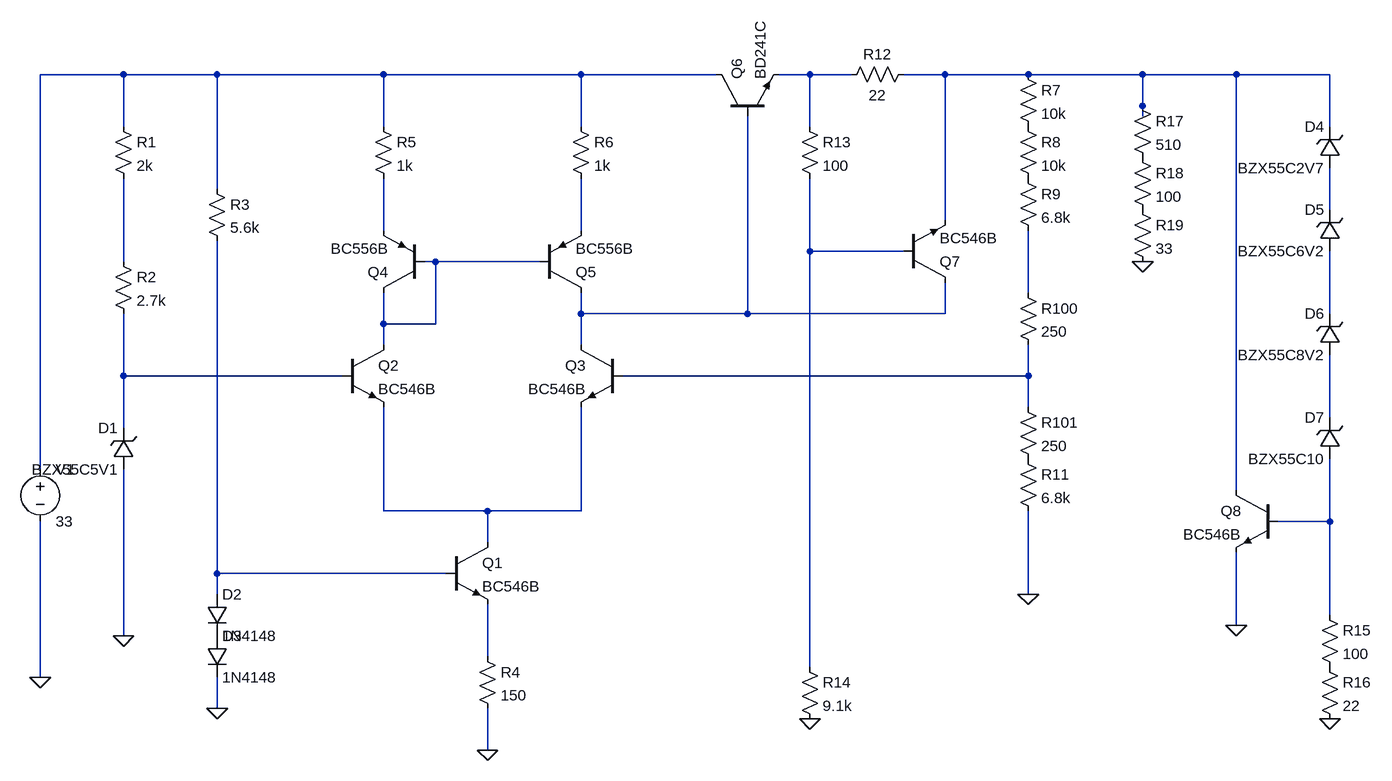
[diagram p0: schematic Draft1.asc]
Draft1.asc, the LTspice schematic file:
Version 4
SHEET 1 2404 680
WIRE 80 -448 -48 -448
WIRE 224 -448 80 -448
WIRE 480 -448 224 -448
WIRE 784 -448 480 -448
WIRE 992 -448 784 -448
WIRE 1136 -448 1088 -448
WIRE 1200 -448 1136 -448
WIRE 1344 -448 1280 -448
WIRE 1472 -448 1344 -448
WIRE 1648 -448 1472 -448
WIRE 1792 -448 1648 -448
WIRE 1936 -448 1792 -448
WIRE 1648 -400 1648 -448
WIRE 1648 -384 1648 -400
WIRE 80 -368 80 -448
WIRE 480 -368 480 -448
WIRE 784 -368 784 -448
WIRE 1136 -368 1136 -448
WIRE 1936 -368 1936 -448
WIRE 224 -272 224 -448
WIRE 1936 -240 1936 -304
WIRE 1344 -224 1344 -448
WIRE 480 -208 480 -288
WIRE 784 -208 784 -288
WIRE 1136 -176 1136 -288
WIRE 1280 -176 1136 -176
WIRE 80 -160 80 -288
WIRE 560 -160 544 -160
WIRE 720 -160 560 -160
WIRE 1472 -112 1472 -208
WIRE 784 -80 784 -112
WIRE 1040 -80 1040 -384
WIRE 1040 -80 784 -80
WIRE 1344 -80 1344 -128
WIRE 1344 -80 1040 -80
WIRE 1936 -80 1936 -176
WIRE 480 -64 480 -112
WIRE 560 -64 560 -160
WIRE 560 -64 480 -64
WIRE 480 -32 480 -64
WIRE 784 -32 784 -80
WIRE 80 16 80 -80
WIRE 416 16 80 16
WIRE 1472 16 1472 -32
WIRE 1472 16 848 16
WIRE 1472 64 1472 16
WIRE 1936 80 1936 -16
WIRE 80 96 80 16
WIRE -48 160 -48 -448
WIRE 1792 192 1792 -448
WIRE 480 224 480 64
WIRE 640 224 480 224
WIRE 784 224 784 64
WIRE 784 224 640 224
WIRE 1936 240 1936 144
WIRE 1936 240 1856 240
WIRE 640 272 640 224
WIRE 224 320 224 -192
WIRE 576 320 224 320
WIRE 224 352 224 320
WIRE 1472 352 1472 224
WIRE 1936 384 1936 240
WIRE 1792 400 1792 288
WIRE 80 416 80 160
WIRE 640 448 640 368
WIRE 1136 464 1136 -176
WIRE -48 480 -48 240
WIRE 224 528 224 480
WIRE 640 592 640 528
FLAG -48 480 0
FLAG 80 416 0
FLAG 224 528 0
FLAG 640 592 0
FLAG 1136 544 0
FLAG 1792 400 0
FLAG 1936 544 0
FLAG 1648 -160 0
FLAG 1472 352 0
SYMBOL voltage -48 144 R0
WINDOW 123 0 0 Left 0
WINDOW 39 0 0 Left 0
SYMATTR InstName V1
SYMATTR Value 33
SYMBOL res 64 -384 R0
SYMATTR InstName R1
SYMATTR Value 2k
SYMBOL res 64 -176 R0
SYMATTR InstName R2
SYMATTR Value 2.7k
SYMBOL zener 96 160 R180
WINDOW 0 24 64 Left 2
WINDOW 3 24 0 Left 2
SYMATTR InstName D1
SYMATTR Value BZX55C5V1
SYMBOL diode 208 352 R0
SYMATTR InstName D2
SYMATTR Value 1N4148
SYMBOL diode 208 416 R0
SYMATTR InstName D3
SYMATTR Value 1N4148
SYMBOL npn 416 -32 R0
SYMATTR InstName Q2
SYMATTR Value BC546B
SYMBOL res 208 -288 R0
SYMATTR InstName R3
SYMATTR Value 5.6k
SYMBOL npn 576 272 R0
SYMATTR InstName Q1
SYMATTR Value BC546B
SYMBOL res 624 432 R0
SYMATTR InstName R4
SYMATTR Value 150
SYMBOL npn 848 -32 M0
SYMATTR InstName Q3
SYMATTR Value BC546B
SYMBOL pnp 544 -112 R180
SYMATTR InstName Q4
SYMATTR Value BC556B
SYMBOL res 464 -384 R0
SYMATTR InstName R5
SYMATTR Value 1k
SYMBOL pnp 720 -112 M180
SYMATTR InstName Q5
SYMATTR Value BC556B
SYMBOL res 768 -384 R0
SYMATTR InstName R6
SYMATTR Value 1k
SYMBOL npn 992 -384 R270
SYMATTR InstName Q6
SYMATTR Value BD241C
SYMBOL res 1120 -384 R0
SYMATTR InstName R13
SYMATTR Value 100
SYMBOL npn 1280 -128 M180
SYMATTR InstName Q7
SYMATTR Value BC546B
SYMBOL res 1296 -464 R90
WINDOW 0 0 56 VBottom 2
WINDOW 3 32 56 VTop 2
SYMATTR InstName R12
SYMATTR Value 22
SYMBOL res 1456 -464 R0
SYMATTR InstName R7
SYMATTR Value 10k
SYMBOL res 1456 -384 R0
SYMATTR InstName R8
SYMATTR Value 10k
SYMBOL res 1456 -304 R0
SYMATTR InstName R9
SYMATTR Value 6.8k
SYMBOL res 1456 -128 R0
SYMATTR InstName R100
SYMATTR Value 250
SYMBOL res 1456 48 R0
SYMATTR InstName R101
SYMATTR Value 250
SYMBOL res 1456 128 R0
SYMATTR InstName R11
SYMATTR Value 6.8k
SYMBOL res 1120 448 R0
SYMATTR InstName R14
SYMATTR Value 9.1k
SYMBOL zener 1952 -304 R180
WINDOW 0 24 64 Left 2
WINDOW 3 24 0 Left 2
SYMATTR InstName D4
SYMATTR Value BZX55C2V7
SYMBOL zener 1952 -176 R180
WINDOW 0 24 64 Left 2
WINDOW 3 24 0 Left 2
SYMATTR InstName D5
SYMATTR Value BZX55C6V2
SYMBOL npn 1856 192 M0
SYMATTR InstName Q8
SYMATTR Value BC546B
SYMBOL res 1920 368 R0
SYMATTR InstName R15
SYMATTR Value 100
SYMBOL res 1920 448 R0
SYMATTR InstName R16
SYMATTR Value 22
SYMBOL res 1632 -416 R0
SYMATTR InstName R17
SYMATTR Value 510
SYMBOL res 1632 -336 R0
SYMATTR InstName R18
SYMATTR Value 100
SYMBOL res 1632 -256 R0
SYMATTR InstName R19
SYMATTR Value 33
SYMBOL zener 1952 -16 R180
WINDOW 0 24 64 Left 2
WINDOW 3 24 0 Left 2
SYMATTR InstName D6
SYMATTR Value BZX55C8V2
SYMBOL zener 1952 144 R180
WINDOW 0 24 64 Left 2
WINDOW 3 24 0 Left 2
SYMATTR InstName D7
SYMATTR Value BZX55C10

The netlist it stands for:
* Draft1.asc
V1 N001 0 33
R1 N001 N008 2k
R2 N008 N013 2.7k
D1 0 N013 BZX55C5V1
D2 N018 P001 1N4148
D3 P001 0 1N4148
Q2 N009 N013 N016 0 BC546B
R3 N001 N018 5.6k
Q1 N016 N018 N019 0 BC546B
R4 N019 0 150
Q3 N011 N014 N016 0 BC546B
Q4 N009 N009 N005 0 BC556B
R5 N001 N005 1k
Q5 N011 N009 N006 0 BC556B
R6 N001 N006 1k
Q6 N001 N011 N002 0 BD241C
R13 N002 N007 100
Q7 N011 N007 N003 0 BC546B
R12 N003 N002 22
R7 N003 P002 10k
R8 P002 P003 10k
R9 P003 N010 6.8k
R100 N010 N014 250
R101 N014 P004 250
R11 P004 0 6.8k
R14 N007 0 9.1k
D4 N004 N003 BZX55C2V7
D5 N012 N004 BZX55C6V2
Q8 N003 N017 0 0 BC546B
R15 N017 P005 100
R16 P005 0 22
R17 N003 P006 510
R18 P006 P007 100
R19 P007 0 33
D6 N015 N012 BZX55C8V2
D7 N017 N015 BZX55C10
.model D D
.lib standard.dio
.model NPN NPN
.model PNP PNP
.lib standard.bjt
.backanno
.end